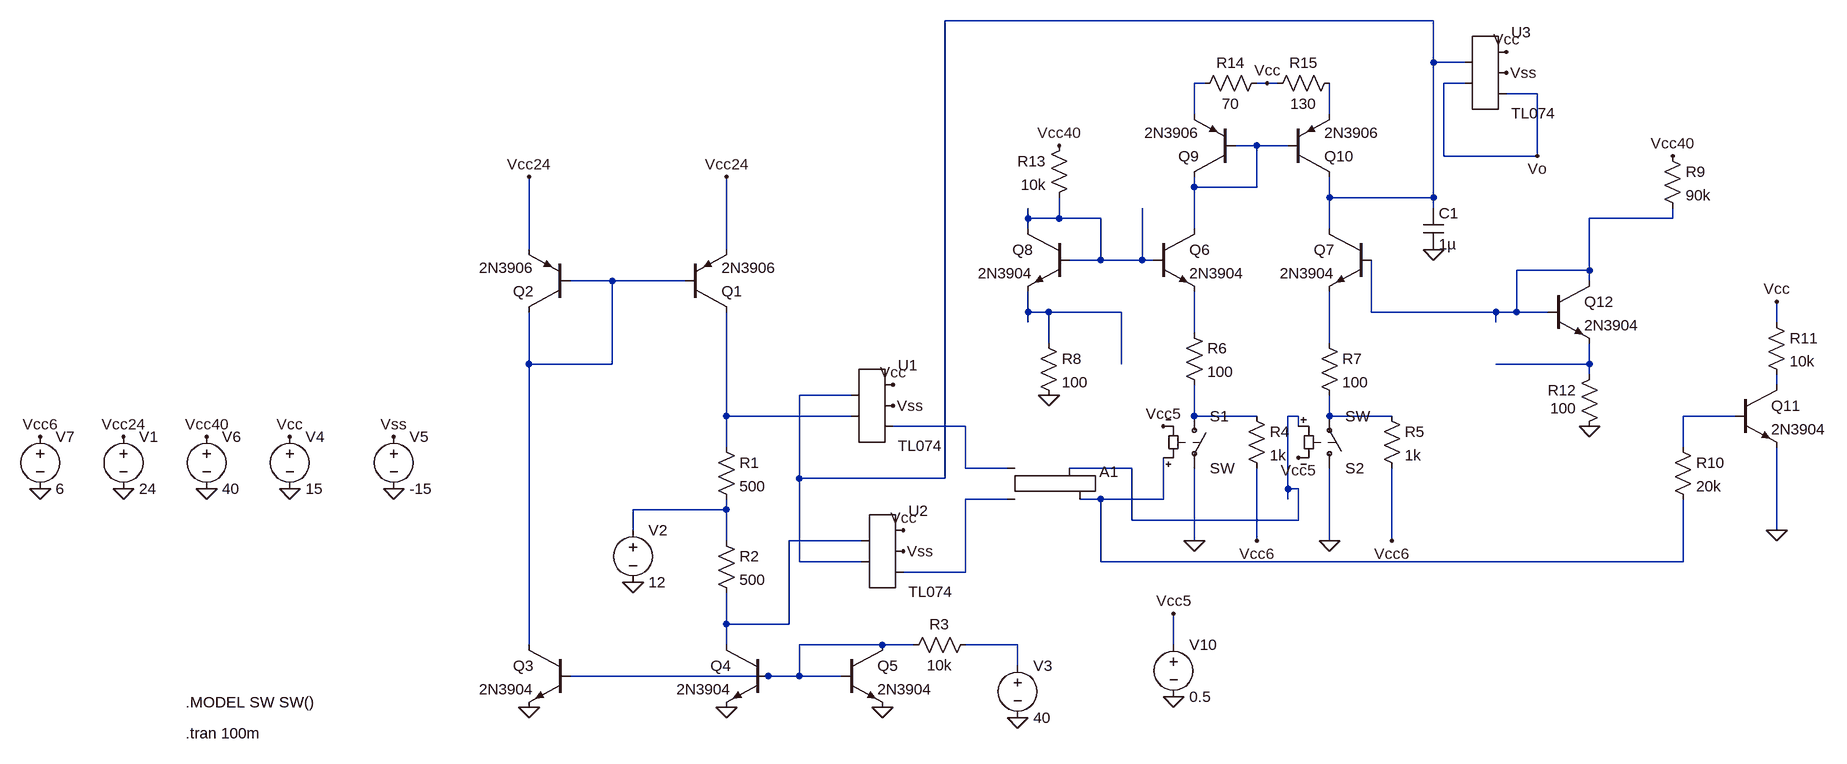
[diagram p0: schematic FreqYDuty.asc]
FreqYDuty.asc, the LTspice schematic file:
Version 4
SHEET 1 1524 680
WIRE 800 -608 48 -608
WIRE 800 -544 800 -608
WIRE 848 -544 800 -544
WIRE 448 -512 432 -512
WIRE 544 -512 528 -512
WIRE 560 -512 544 -512
WIRE 848 -512 816 -512
WIRE 960 -496 912 -496
WIRE 432 -464 432 -512
WIRE 640 -464 640 -512
WIRE 528 -416 496 -416
WIRE 576 -416 528 -416
WIRE 816 -400 816 -512
WIRE 960 -400 960 -496
WIRE 960 -400 816 -400
WIRE 432 -352 432 -368
WIRE 528 -352 528 -416
WIRE 528 -352 432 -352
WIRE 640 -336 640 -368
WIRE 800 -336 800 -544
WIRE 800 -336 640 -336
WIRE 800 -320 800 -336
WIRE 176 -304 176 -320
WIRE 224 -304 224 -336
WIRE 224 -304 176 -304
WIRE 288 -304 224 -304
WIRE 1168 -304 1168 -320
WIRE 1168 -304 1040 -304
WIRE 176 -288 176 -304
WIRE 432 -288 432 -352
WIRE 640 -288 640 -336
WIRE -592 -256 -592 -368
WIRE -288 -256 -288 -368
WIRE 288 -240 288 -304
WIRE 288 -240 240 -240
WIRE 352 -240 352 -320
WIRE 352 -240 288 -240
WIRE 368 -240 352 -240
WIRE 1040 -224 1040 -304
WIRE 1040 -224 928 -224
WIRE -464 -208 -528 -208
WIRE -352 -208 -464 -208
WIRE 1040 -208 1040 -224
WIRE 176 -160 176 -192
WIRE 208 -160 176 -160
WIRE 320 -160 208 -160
WIRE 704 -160 704 -240
WIRE 896 -160 704 -160
WIRE 928 -160 928 -224
WIRE 928 -160 896 -160
WIRE 976 -160 928 -160
WIRE 176 -144 176 -160
WIRE 896 -144 896 -160
WIRE 1328 -144 1328 -176
WIRE 432 -128 432 -192
WIRE 208 -112 208 -160
WIRE 640 -112 640 -192
WIRE -592 -80 -592 -160
WIRE -464 -80 -464 -208
WIRE -464 -80 -592 -80
WIRE 320 -80 320 -160
WIRE 1040 -80 1040 -112
WIRE 1040 -80 896 -80
WIRE 1040 -64 1040 -80
WIRE 1328 -48 1328 -64
WIRE -96 -32 -176 -32
WIRE -288 0 -288 -160
WIRE -96 0 -288 0
WIRE 432 0 432 -48
WIRE 528 0 432 0
WIRE 592 0 576 0
WIRE 640 0 640 -32
WIRE 736 0 640 0
WIRE 1264 0 1184 0
WIRE 80 16 -32 16
WIRE 592 16 592 0
WIRE -288 48 -288 0
WIRE 1184 48 1184 0
WIRE 80 80 80 16
WIRE 144 80 80 80
WIRE 336 80 240 80
WIRE -176 96 -176 -32
WIRE 48 96 48 -608
WIRE 48 96 -176 96
WIRE 576 112 576 0
WIRE 592 112 576 112
WIRE 144 128 80 128
WIRE 288 128 256 128
WIRE 384 128 384 64
WIRE 384 128 288 128
WIRE 576 128 576 112
WIRE -288 144 -288 128
WIRE -288 144 -432 144
WIRE 336 160 336 80
WIRE 592 160 592 112
WIRE 592 160 336 160
WIRE -432 176 -432 144
WIRE 1328 176 1328 48
WIRE -288 192 -288 144
WIRE -80 192 -192 192
WIRE 432 192 432 80
WIRE 528 192 528 80
WIRE 640 192 640 80
WIRE 736 192 736 80
WIRE -176 224 -176 96
WIRE -80 224 -176 224
WIRE 288 224 288 128
WIRE 1184 224 1184 128
WIRE 1184 224 288 224
WIRE 80 240 80 128
WIRE 80 240 -16 240
WIRE -288 320 -288 272
WIRE -192 320 -192 192
WIRE -192 320 -288 320
WIRE -592 352 -592 -80
WIRE -288 352 -288 320
WIRE -48 352 -176 352
WIRE 0 352 -48 352
WIRE 160 352 80 352
WIRE 400 352 400 304
WIRE 160 384 160 352
WIRE -224 400 -528 400
WIRE -176 400 -176 352
WIRE -176 400 -224 400
WIRE -112 400 -176 400
FLAG -432 256 0
FLAG 160 464 0
FLAG -48 448 0
FLAG -288 448 0
FLAG -592 448 0
FLAG -960 32 Vcc
FLAG -800 32 Vss
FLAG -800 112 0
FLAG -960 112 0
FLAG -32 -48 Vcc
FLAG -32 -16 Vss
FLAG -16 208 Vss
FLAG -16 176 Vcc
FLAG 432 192 0
FLAG 640 192 0
FLAG 208 -32 0
FLAG -1088 32 Vcc40
FLAG -1088 112 0
FLAG 800 -256 0
FLAG -592 -368 Vcc24
FLAG -288 -368 Vcc24
FLAG 544 -512 Vcc
FLAG 912 -560 Vcc
FLAG 912 -528 Vss
FLAG 960 -400 Vo
FLAG -1216 32 Vcc24
FLAG -1216 112 0
FLAG -1344 32 Vcc6
FLAG -1344 112 0
FLAG 736 192 Vcc6
FLAG 528 192 Vcc6
FLAG 400 432 0
FLAG 400 304 Vcc5
FLAG 384 16 Vcc5
FLAG 592 64 Vcc5
FLAG 1328 176 0
FLAG 1328 -176 Vcc
FLAG 1040 16 0
FLAG 1168 -400 Vcc40
FLAG 224 -416 Vcc40
DATAFLAG -272 320 ""
DATAFLAG -288 -48 ""
SYMBOL pnp -352 -160 M180
SYMATTR InstName Q1
SYMATTR Value 2N3906
SYMBOL pnp -528 -160 R180
SYMATTR InstName Q2
SYMATTR Value 2N3906
SYMBOL npn -528 352 M0
SYMATTR InstName Q3
SYMATTR Value 2N3904
SYMBOL res -304 32 R0
SYMATTR InstName R1
SYMATTR Value 500
SYMBOL res -304 176 R0
SYMATTR InstName R2
SYMATTR Value 500
SYMBOL voltage -432 160 R0
WINDOW 123 0 0 Left 0
WINDOW 39 0 0 Left 0
SYMATTR InstName V2
SYMATTR Value 12
SYMBOL npn -224 352 M0
SYMATTR InstName Q4
SYMATTR Value 2N3904
SYMBOL npn -112 352 R0
SYMATTR InstName Q5
SYMATTR Value 2N3904
SYMBOL AutoGenerated\\TL074 -64 -16 R0
SYMATTR InstName U1
SYMBOL AutoGenerated\\TL074 -48 208 R0
SYMATTR InstName U2
SYMBOL res 96 336 R90
WINDOW 0 0 56 VBottom 2
WINDOW 3 32 56 VTop 2
SYMATTR InstName R3
SYMATTR Value 10k
SYMBOL voltage 160 368 R0
WINDOW 123 0 0 Left 0
WINDOW 39 0 0 Left 0
SYMATTR InstName V3
SYMATTR Value 40
SYMBOL Digital\\srflop 192 32 R0
SYMATTR InstName A1
SYMBOL voltage -960 16 R0
WINDOW 123 0 0 Left 0
WINDOW 39 0 0 Left 0
SYMATTR InstName V4
SYMATTR Value 15
SYMBOL voltage -800 16 R0
WINDOW 123 0 0 Left 0
WINDOW 39 0 0 Left 0
SYMATTR InstName V5
SYMATTR Value -15
SYMBOL sw 432 -16 R0
SYMATTR InstName S1
SYMBOL sw 640 96 M180
SYMATTR InstName S2
SYMBOL res 512 -16 R0
SYMATTR InstName R4
SYMATTR Value 1k
SYMBOL res 720 -16 R0
SYMATTR InstName R5
SYMATTR Value 1k
SYMBOL res 416 -144 R0
SYMATTR InstName R6
SYMATTR Value 100
SYMBOL res 624 -128 R0
SYMATTR InstName R7
SYMATTR Value 100
SYMBOL npn 704 -288 M0
SYMATTR InstName Q7
SYMATTR Value 2N3904
SYMBOL npn 368 -288 R0
SYMATTR InstName Q6
SYMATTR Value 2N3904
SYMBOL npn 240 -288 M0
SYMATTR InstName Q8
SYMATTR Value 2N3904
SYMBOL res 192 -128 R0
SYMATTR InstName R8
SYMATTR Value 100
SYMBOL res 1152 -416 R0
SYMATTR InstName R9
SYMATTR Value 90k
SYMBOL voltage -1088 16 R0
WINDOW 123 0 0 Left 0
WINDOW 39 0 0 Left 0
SYMATTR InstName V6
SYMATTR Value 40
SYMBOL cap 784 -320 R0
SYMATTR InstName C1
SYMATTR Value 1µ
SYMBOL pnp 496 -368 R180
SYMATTR InstName Q9
SYMATTR Value 2N3906
SYMBOL pnp 576 -368 M180
SYMATTR InstName Q10
SYMATTR Value 2N3906
SYMBOL AutoGenerated\\TL074 880 -528 R0
SYMATTR InstName U3
SYMBOL voltage -1216 16 R0
WINDOW 123 0 0 Left 0
WINDOW 39 0 0 Left 0
SYMATTR InstName V1
SYMATTR Value 24
SYMBOL voltage -1344 16 R0
WINDOW 123 0 0 Left 0
WINDOW 39 0 0 Left 0
SYMATTR InstName V7
SYMATTR Value 6
SYMBOL voltage 400 336 R0
WINDOW 123 0 0 Left 0
WINDOW 39 0 0 Left 0
SYMATTR InstName V10
SYMATTR Value 0.5
SYMBOL npn 1264 -48 R0
SYMATTR InstName Q11
SYMATTR Value 2N3904
SYMBOL res 1168 32 R0
SYMATTR InstName R10
SYMATTR Value 20k
SYMBOL res 1312 -160 R0
SYMATTR InstName R11
SYMATTR Value 10k
SYMBOL npn 976 -208 R0
SYMATTR InstName Q12
SYMATTR Value 2N3904
SYMBOL res 1056 -80 M0
WINDOW 3 36 68 Left 2
SYMATTR Value 100
SYMATTR InstName R12
SYMBOL res 240 -432 M0
SYMATTR InstName R13
SYMATTR Value 10k
SYMBOL res 544 -528 R90
WINDOW 0 0 56 VBottom 2
WINDOW 3 32 56 VTop 2
SYMATTR InstName R14
SYMATTR Value 70
SYMBOL res 656 -528 R90
WINDOW 0 0 56 VBottom 2
WINDOW 3 32 56 VTop 2
SYMATTR InstName R15
SYMATTR Value 130
TEXT -1120 488 Left 2 !.tran 100m
TEXT -1120 440 Left 2 !.MODEL SW SW()

The netlist it stands for:
* FreqYDuty.asc
Q1 N013 N007 Vcc24 0 2N3906
Q2 N007 N007 Vcc24 0 2N3906
Q3 N007 N023 0 0 2N3904
R1 N013 N021 500
R2 N021 N022 500
V2 N021 0 12
Q4 N022 N023 0 0 2N3904
Q5 N023 N023 0 0 2N3904
* U1: TL074 (symbol AutoGenerated\TL074 not available, pins judged from their places): pin1=N001 pin2=N013 pin3=Vcc pin4=Vss pin5=N018
* U2: TL074 (symbol AutoGenerated\TL074 not available, pins judged from their places): pin1=N022 pin2=N001 pin3=Vcc pin4=Vss pin5=N019
R3 N024 N023 10k
V3 N024 0 40
A1 N018 N019 0 0 0 N020 N015 0 SRFLOP
V4 Vcc 0 15
V5 Vss 0 -15
S1 N014 0 N020 Vcc5 SW
S2 0 N016 N015 Vcc5 SW
R4 N014 Vcc6 1k
R5 N016 Vcc6 1k
R6 N009 N014 100
R7 N010 N016 100
Q7 N001 N006 N010 0 2N3904
Q6 N004 N005 N009 0 2N3904
Q8 N005 N005 N008 0 2N3904
R8 N008 0 100
R9 Vcc40 N006 90k
V6 Vcc40 0 40
C1 N001 0 1µ
Q9 N004 N004 N002 0 2N3906
Q10 N001 N004 N003 0 2N3906
* U3: TL074 (symbol AutoGenerated\TL074 not available, pins judged from their places): pin1=N001 pin2=Vo pin3=Vcc pin4=Vss pin5=Vo
V1 Vcc24 0 24
V7 Vcc6 0 6
V10 Vcc5 0 0.5
Q11 N012 N017 0 0 2N3904
R10 N017 N020 20k
R11 Vcc N012 10k
Q12 N006 N006 N011 0 2N3904
R12 N011 0 100
R13 Vcc40 N005 10k
R14 Vcc N002 70
R15 N003 Vcc 130
.model NPN NPN
.model PNP PNP
.lib standard.bjt
.tran 100m
.MODEL SW SW()
.backanno
.end